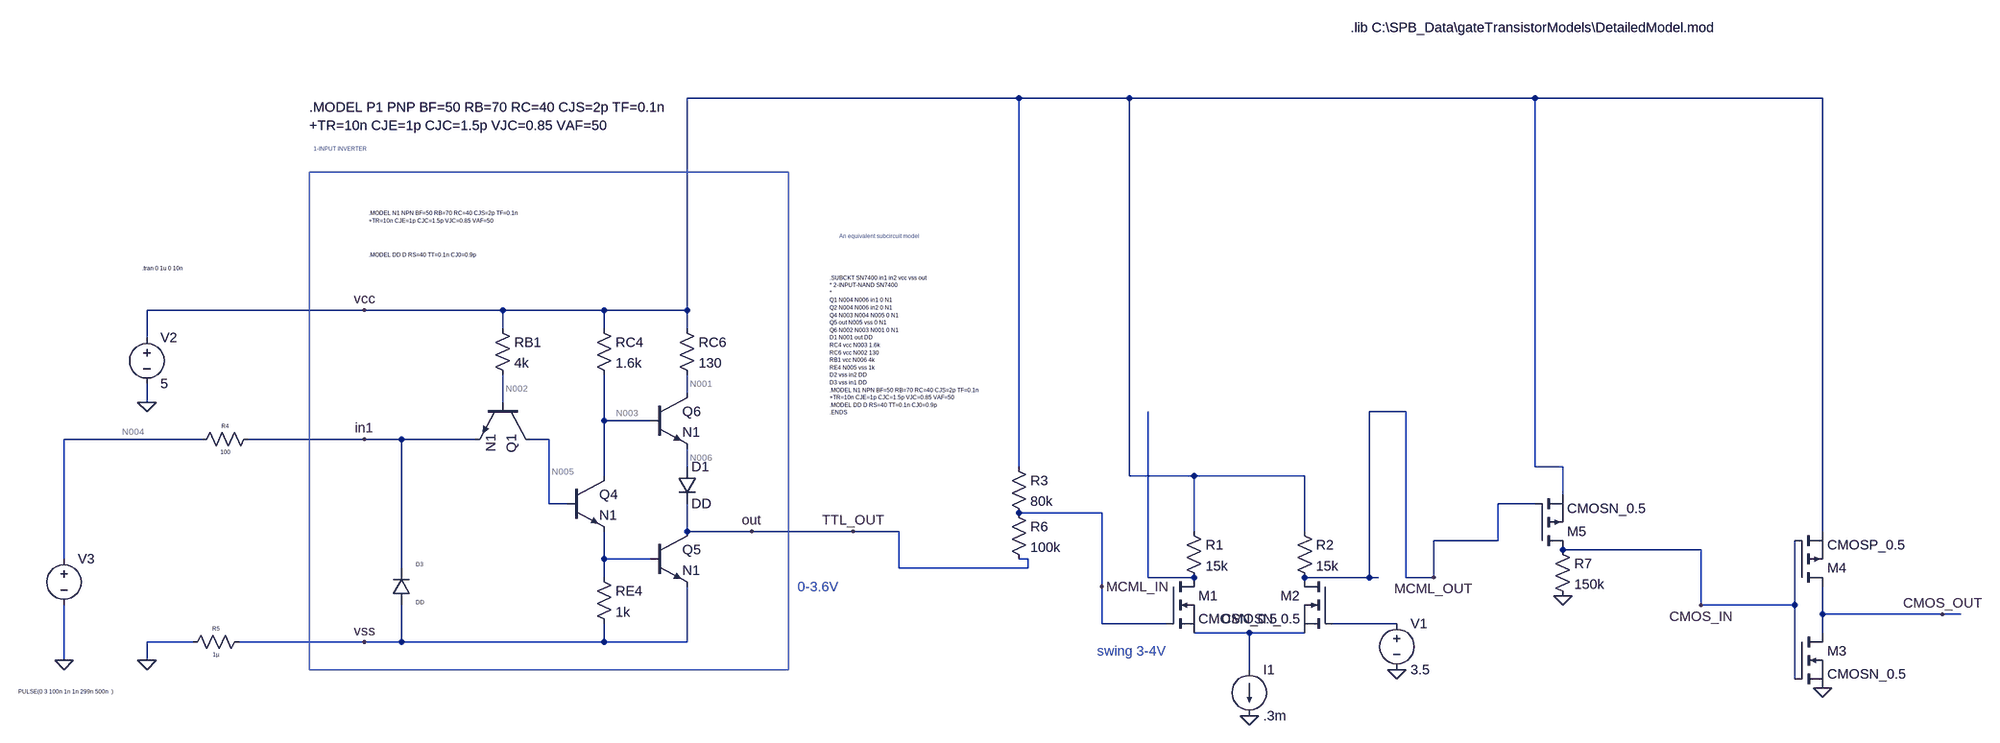
[diagram p0: schematic ttl_inverter.asc]
ttl_inverter.asc, the LTspice schematic file:
Version 4
SHEET 1 2708 904
WIRE 976 -400 400 -400
WIRE 1168 -400 976 -400
WIRE 1872 -400 1168 -400
WIRE 2416 -400 1872 -400
WIRE -160 -32 -656 -32
WIRE 80 -32 -160 -32
WIRE 256 -32 80 -32
WIRE 400 -32 400 -400
WIRE 400 -32 256 -32
WIRE 80 0 80 -32
WIRE 256 0 256 -32
WIRE 400 0 400 -32
WIRE -656 16 -656 -32
WIRE 400 112 400 80
WIRE -656 128 -656 96
WIRE 80 128 80 80
WIRE 1648 144 1584 144
WIRE 256 160 256 80
WIRE 336 160 256 160
WIRE -560 192 -800 192
WIRE -160 192 -480 192
WIRE -96 192 -160 192
WIRE 32 192 -96 192
WIRE 160 192 128 192
WIRE 400 240 400 208
WIRE 976 240 976 -400
WIRE 1872 240 1872 -400
WIRE 1920 240 1872 240
WIRE 256 256 256 160
WIRE 1168 256 1168 -400
WIRE 1280 256 1168 256
WIRE 1472 256 1280 256
WIRE 1920 288 1920 240
WIRE 160 304 160 192
WIRE 192 304 160 304
WIRE 1872 304 1808 304
WIRE 1120 320 976 320
WIRE 400 352 400 304
WIRE 512 352 400 352
WIRE 688 352 512 352
WIRE 768 352 688 352
WIRE 1280 352 1280 256
WIRE 1472 352 1472 256
WIRE 2416 352 2416 -400
WIRE 1808 368 1808 304
WIRE 1808 368 1696 368
WIRE 2160 384 1920 384
WIRE -800 400 -800 192
WIRE 256 400 256 352
WIRE 336 400 256 400
WIRE 992 400 976 400
WIRE -96 416 -96 192
WIRE 768 416 768 352
WIRE 992 416 992 400
WIRE 992 416 768 416
WIRE 256 432 256 400
WIRE 1200 432 1200 144
WIRE 1280 432 1200 432
WIRE 1584 432 1584 144
WIRE 1584 432 1472 432
WIRE 1600 432 1584 432
WIRE 1648 432 1648 144
WIRE 1696 432 1696 368
WIRE 1696 432 1648 432
WIRE 1120 448 1120 320
WIRE 2160 480 2160 384
WIRE 2368 480 2368 368
WIRE 2368 480 2160 480
WIRE 2416 496 2416 448
WIRE 2624 496 2416 496
WIRE 2656 496 2624 496
WIRE 1120 512 1120 448
WIRE 1232 512 1120 512
WIRE 1632 512 1520 512
WIRE 1376 528 1280 528
WIRE 1472 528 1376 528
WIRE 2416 528 2416 496
WIRE -576 544 -656 544
WIRE -160 544 -496 544
WIRE -96 544 -96 480
WIRE -96 544 -160 544
WIRE 256 544 256 512
WIRE 256 544 -96 544
WIRE 400 544 400 448
WIRE 400 544 256 544
WIRE -800 576 -800 480
WIRE -656 576 -656 544
WIRE 1376 592 1376 528
WIRE 2368 608 2368 480
FLAG -656 576 0
FLAG -656 128 0
FLAG 512 352 out
FLAG -160 192 in1
FLAG -160 -32 vcc
FLAG -160 544 vss
FLAG -800 576 0
FLAG 1376 672 0
FLAG 1632 592 0
FLAG 2416 624 0
FLAG 2624 496 CMOS_OUT
FLAG 2160 480 CMOS_IN
FLAG 1696 432 MCML_OUT
FLAG 1120 448 MCML_IN
FLAG 688 352 TTL_OUT
FLAG 1920 464 0
SYMBOL npn 128 128 R90
SYMATTR InstName Q1
SYMATTR Value N1
SYMBOL npn 192 256 R0
SYMATTR InstName Q4
SYMATTR Value N1
SYMBOL npn 336 352 R0
SYMATTR InstName Q5
SYMATTR Value N1
SYMBOL npn 336 112 R0
SYMATTR InstName Q6
SYMATTR Value N1
SYMBOL diode 384 240 R0
SYMATTR InstName D1
SYMATTR Value DD
SYMBOL res 240 -16 R0
SYMATTR InstName RC4
SYMATTR Value 1.6k
SYMBOL res 384 -16 R0
SYMATTR InstName RC6
SYMATTR Value 130
SYMBOL res 64 -16 R0
SYMATTR InstName RB1
SYMATTR Value 4k
SYMBOL res 240 416 R0
SYMATTR InstName RE4
SYMATTR Value 1k
SYMBOL voltage -656 0 R0
SYMATTR InstName V2
SYMATTR Value 5
SYMBOL res -576 208 R270
WINDOW 0 32 56 VTop 0
WINDOW 3 0 56 VBottom 0
SYMATTR InstName R4
SYMATTR Value 100
SYMBOL res -592 560 R270
WINDOW 0 32 56 VTop 0
WINDOW 3 0 56 VBottom 0
SYMATTR InstName R5
SYMATTR Value 1µ
SYMBOL diode -80 480 R180
WINDOW 0 -22 70 Left 0
WINDOW 3 -24 4 Left 0
SYMATTR InstName D3
SYMATTR Value DD
SYMBOL voltage -800 384 R0
WINDOW 123 0 0 Left 0
WINDOW 39 0 0 Left 0
WINDOW 3 -79 247 Left 0
SYMATTR Value PULSE(0 3 100n 1n 1n 299n 500n  )
SYMATTR InstName V3
SYMBOL nmos 1232 432 R0
SYMATTR InstName M1
SYMATTR Value CMOSN_0.5
SYMBOL nmos 1520 432 M0
SYMATTR InstName M2
SYMATTR Value CMOSN_0.5
SYMBOL current 1376 592 R0
SYMATTR InstName I1
SYMATTR Value .3m
SYMBOL res 1264 336 R0
SYMATTR InstName R1
SYMATTR Value 15k
SYMBOL res 1456 336 R0
SYMATTR InstName R2
SYMATTR Value 15k
SYMBOL voltage 1632 496 R0
SYMATTR InstName V1
SYMATTR Value 3.5
SYMBOL res 960 224 R0
SYMATTR InstName R3
SYMATTR Value 80k
SYMBOL res 960 304 R0
SYMATTR InstName R6
SYMATTR Value 100k
SYMBOL nmos 2368 528 R0
SYMATTR InstName M3
SYMATTR Value CMOSN_0.5
SYMBOL pmos 2368 448 M180
SYMATTR InstName M4
SYMATTR Value CMOSP_0.5
SYMBOL res 1904 368 R0
SYMATTR InstName R7
SYMATTR Value 150k
SYMBOL pmos 1872 384 M180
SYMATTR InstName M5
SYMATTR Value CMOSN_0.5
TEXT -152 -200 Left 0 !.MODEL N1 NPN BF=50 RB=70 RC=40 CJS=2p TF=0.1n\n+TR=10n CJE=1p CJC=1.5p VJC=0.85 VAF=50
TEXT -152 -128 Left 0 !.MODEL DD D RS=40 TT=0.1n CJ0=0.9p
TEXT -664 -104 Left 0 !.tran 0 1u 0 10n
TEXT -248 -312 Left 0 ;1-INPUT INVERTER
TEXT 648 -88 Left 0 !.SUBCKT SN7400 in1 in2 vcc vss out\n* 2-INPUT-NAND SN7400\n*\nQ1 N004 N006 in1 0 N1\nQ2 N004 N006 in2 0 N1\nQ4 N003 N004 N005 0 N1\nQ5 out N005 vss 0 N1\nQ6 N002 N003 N001 0 N1\nD1 N001 out DD\nRC4 vcc N003 1.6k\nRC6 vcc N002 130\nRB1 vcc N006 4k\nRE4 N005 vss 1k\nD2 vss in2 DD\nD3 vss in1 DD\n.MODEL N1 NPN BF=50 RB=70 RC=40 CJS=2p TF=0.1n\n+TR=10n CJE=1p CJC=1.5p VJC=0.85 VAF=50\n.MODEL DD D RS=40 TT=0.1n CJ0=0.9p\n.ENDS
TEXT 664 -160 Left 0 ;An equivalent subcircuit model
TEXT 1112 560 Left 2 ;swing 3-4V
TEXT 592 448 Left 2 ;0-3.6V
TEXT 1552 -688 Left 2 !.lib C:\\SPB_Data\\gateTransistorModels\\DetailedModel.mod
TEXT -256 -384 Left 2 !.MODEL P1 PNP BF=50 RB=70 RC=40 CJS=2p TF=0.1n\n+TR=10n CJE=1p CJC=1.5p VJC=0.85 VAF=50
RECTANGLE Normal 576 592 -256 -272

The netlist it stands for:
* ttl_inverter.asc
Q1 N005 N002 in1 0 N1
Q4 N003 N005 N007 0 N1
Q5 TTL_OUT N007 vss 0 N1
Q6 N001 N003 N006 0 N1
D1 N006 TTL_OUT DD
RC4 vcc N003 1.6k
RC6 vcc N001 130
RB1 vcc N002 4k
RE4 N007 vss 1k
V2 vcc 0 5
R4 N004 in1 100
R5 0 vss 1µ
D3 vss in1 DD
V3 N004 0 PULSE(0 3 100n 1n 1n 299n 500n  )
M1 N008 MCML_IN N010 N010 CMOSN_0.5
M2 MCML_OUT N009 N010 N010 CMOSN_0.5
I1 N010 0 .3m
R1 vcc N008 15k
R2 vcc MCML_OUT 15k
V1 N009 0 3.5
R3 vcc MCML_IN 80k
R6 MCML_IN TTL_OUT 100k
M3 CMOS_OUT CMOS_IN 0 0 CMOSN_0.5
M4 CMOS_OUT CMOS_IN vcc vcc CMOSP_0.5
R7 CMOS_IN 0 150k
M5 CMOS_IN MCML_OUT vcc vcc CMOSN_0.5
.model D D
.lib standard.dio
.model NPN NPN
.model PNP PNP
.lib standard.bjt
.model NMOS NMOS
.model PMOS PMOS
.lib standard.mos
.MODEL N1 NPN BF=50 RB=70 RC=40 CJS=2p TF=0.1n
+TR=10n CJE=1p CJC=1.5p VJC=0.85 VAF=50
.MODEL DD D RS=40 TT=0.1n CJ0=0.9p
.tran 0 1u 0 10n
* 1-INPUT INVERTER
.SUBCKT SN7400 in1 in2 vcc vss out
* 2-INPUT-NAND SN7400
*
Q1 N004 N006 in1 0 N1
Q2 N004 N006 in2 0 N1
Q4 N003 N004 N005 0 N1
Q5 out N005 vss 0 N1
Q6 N002 N003 N001 0 N1
D1 N001 out DD
RC4 vcc N003 1.6k
RC6 vcc N002 130
RB1 vcc N006 4k
RE4 N005 vss 1k
D2 vss in2 DD
D3 vss in1 DD
.MODEL N1 NPN BF=50 RB=70 RC=40 CJS=2p TF=0.1n
+TR=10n CJE=1p CJC=1.5p VJC=0.85 VAF=50
.MODEL DD D RS=40 TT=0.1n CJ0=0.9p
.ENDS
* An equivalent subcircuit model
* swing 3-4V
* 0-3.6V
.lib C:\SPB_Data\gateTransistorModels\DetailedModel.mod
.MODEL P1 PNP BF=50 RB=70 RC=40 CJS=2p TF=0.1n
+TR=10n CJE=1p CJC=1.5p VJC=0.85 VAF=50
.backanno
.end